# EasyEDA Pro project AG6NS_PicoBalloon_RP2040_v0.31.eprj, schematic Schematic1
Create Date: 2023-01-16; Page Name: P1; Project Name: PicoBalloon RP2040 v0.31; Schematic Name: Schematic1; Update Date: 2023-05-23; Company: AG6NS  Kazu Terasaki; Drawed: EasyEDA Pro; Page Size: A3; Part Number: JLCPCB-001; Reviewed: EasyEDA Pro; Version: 2023.05.17
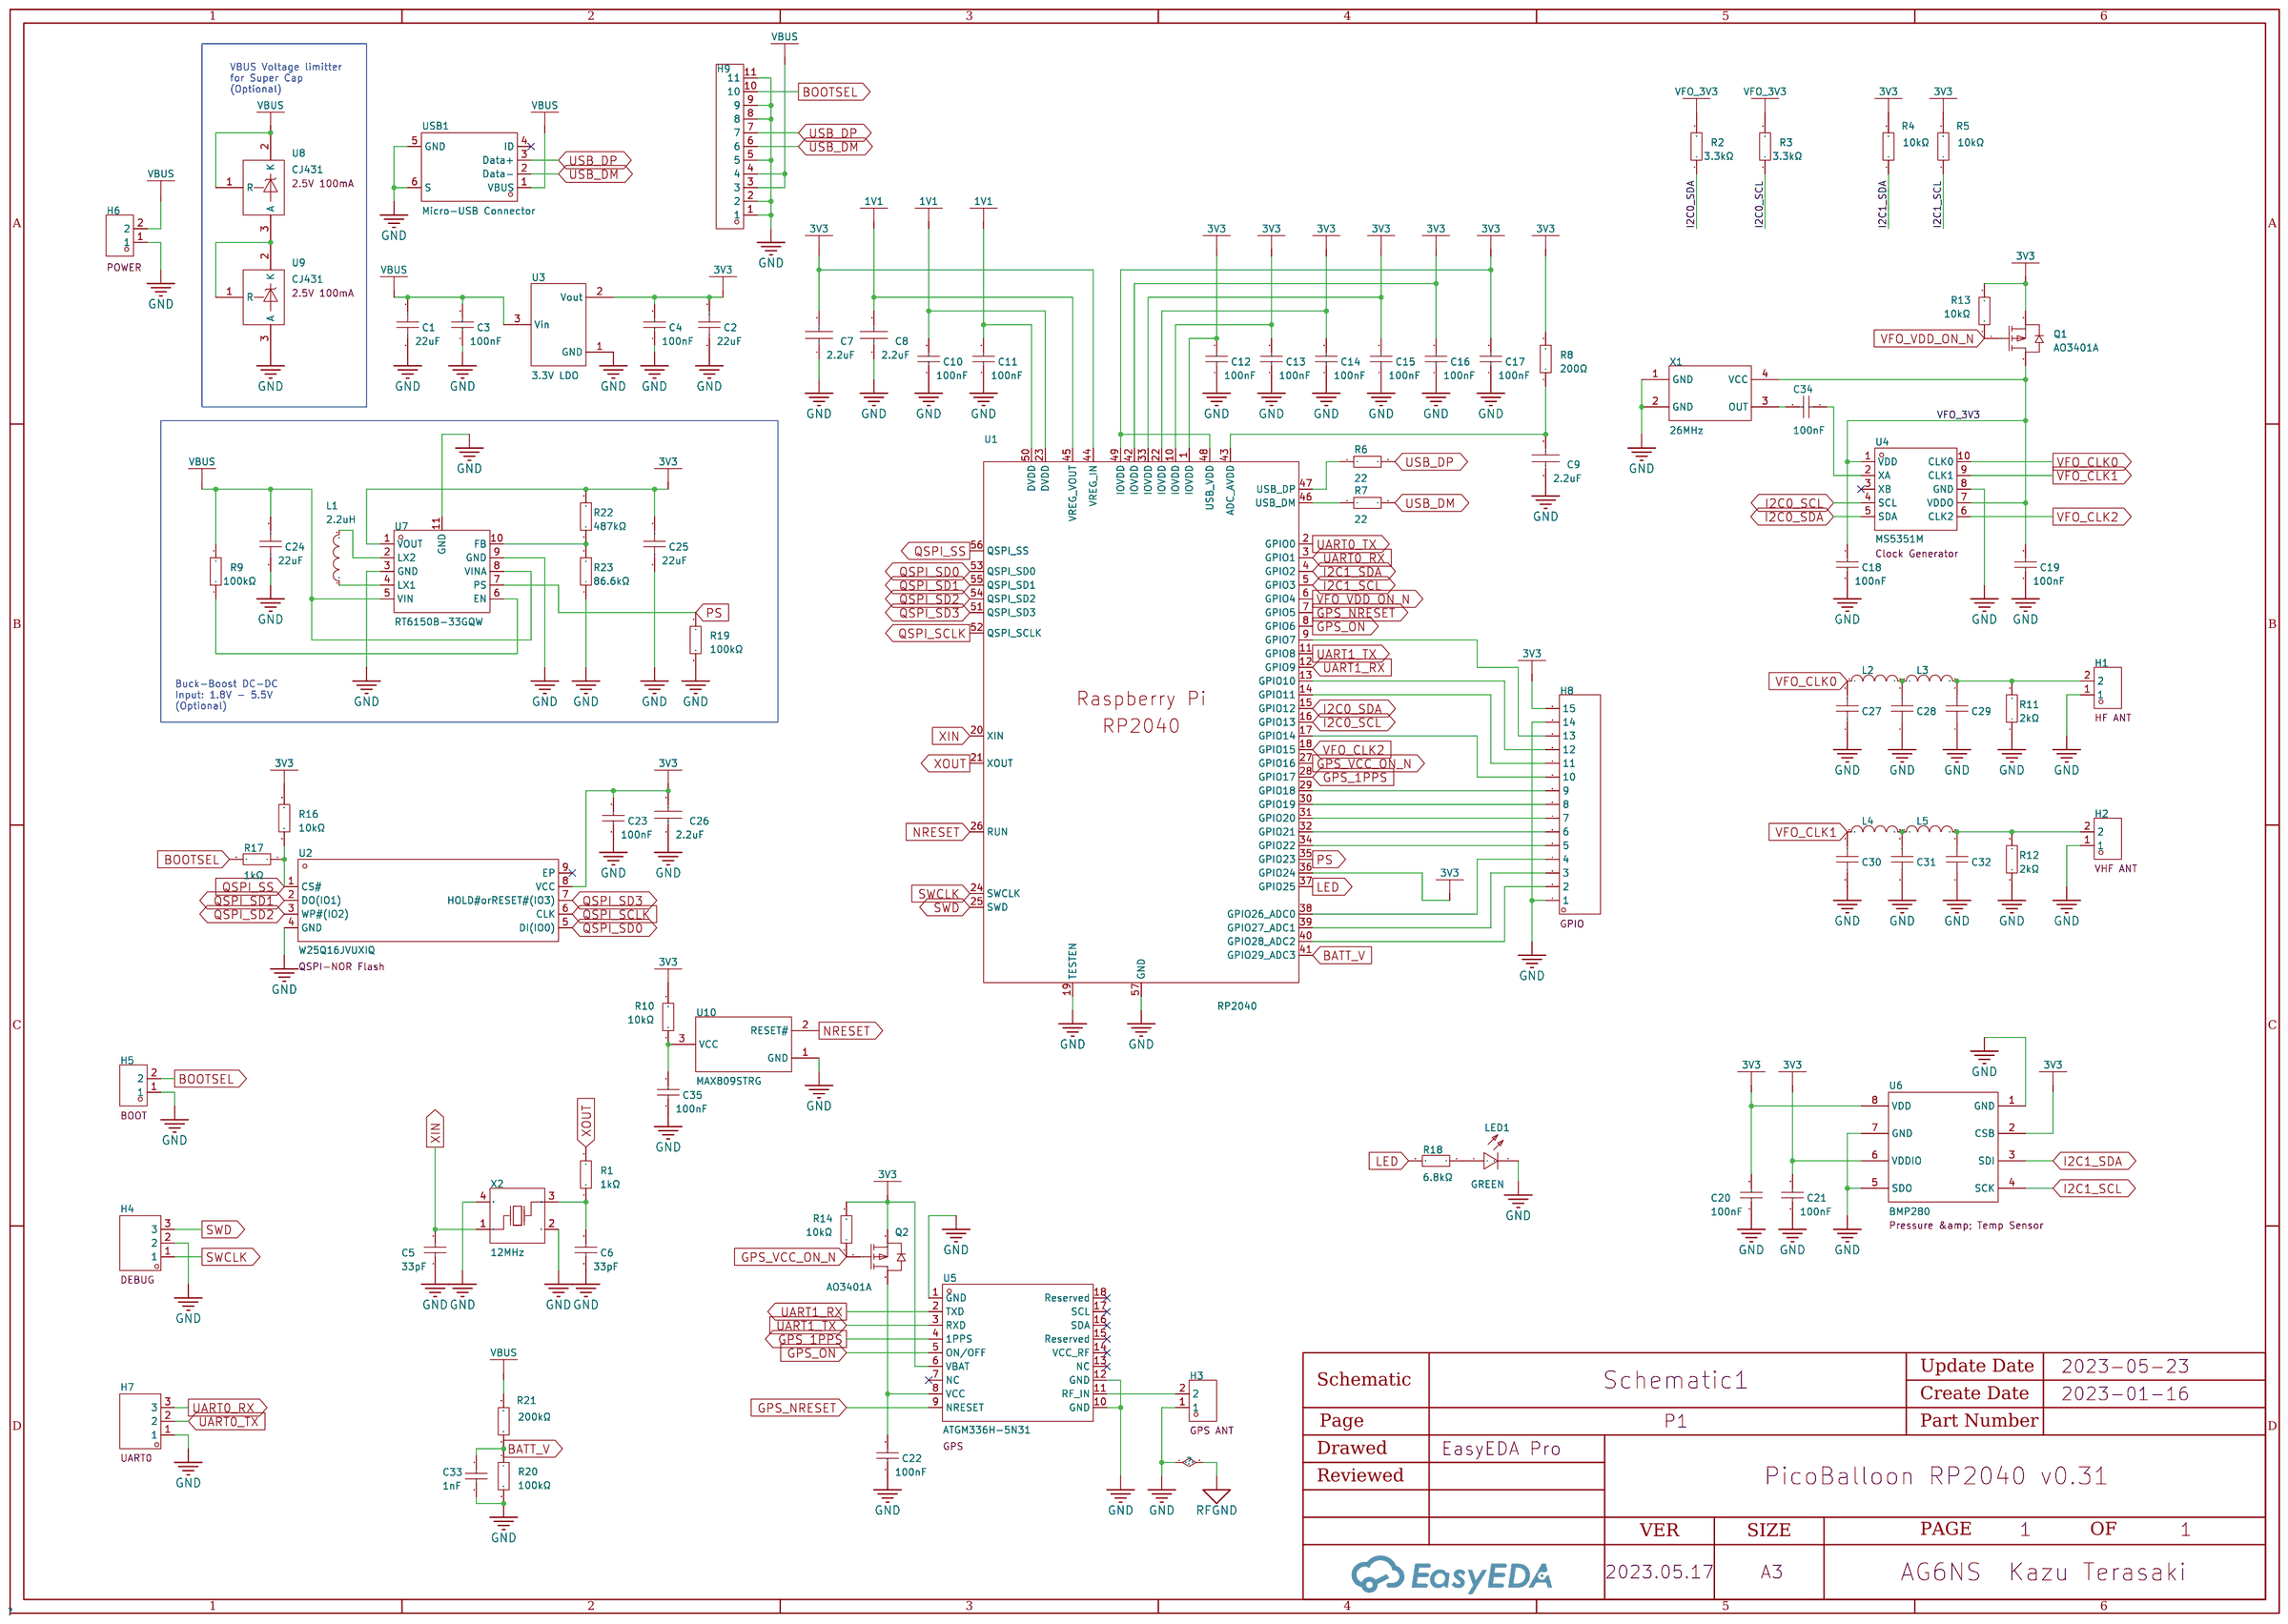
[diagram p0: schematic sheet]

## Parts
C1  22uF  [C0805]
C2  22uF  [C0603]
C3  100nF  [C0402_NEW]
C4  100nF  [C0402_NEW]
C5  33pF  [C0402]
C6  33pF  [C0402]
C7  2.2uF  [C0402]
C8  2.2uF  [C0402]
C9  2.2uF  [C0402]
C10  100nF  [C0402_NEW]
C11  100nF  [C0402_NEW]
C12  100nF  [C0402_NEW]
C13  100nF  [C0402_NEW]
C14  100nF  [C0402_NEW]
C15  100nF  [C0402_NEW]
C16  100nF  [C0402_NEW]
C17  100nF  [C0402_NEW]
C18  100nF  [C0402_NEW]
C19  100nF  [C0402_NEW]
C20  100nF  [C0402_NEW]
C21  100nF  [C0402_NEW]
C22  100nF  [C0402_NEW]
C23  100nF  [C0402_NEW]
C24  22uF  [C0805]  (no BOM)
C25  22uF  [C0603]  (no BOM)
C26  2.2uF  [C0402]
C27  330pF  [C0805]  (no BOM)
C28  330pF  [C0805]  (no BOM)
C29  330pF  [C0805]  (no BOM)
C30  330pF  [C0805]  (no BOM)
C31  330pF  [C0805]  (no BOM)
C32  330pF  [C0805]  (no BOM)
C33  1nF  [C0402]
C34  100nF  [C0402_NEW]
C35  100nF  [C0402_NEW]
H1  210-91-02GB01  [HDR-TH_2P-P2.54-V-M-1]  (no BOM)
H2  210-91-02GB01  [HDR-TH_2P-P2.54-V-M-1]  (no BOM)
H3  210-91-02GB01  [HDR-TH_2P-P2.54-V-M-1]  (no BOM)
H4  B-2100S03P-A110  [HDR-TH_3P-P2.54-V-M-1]  (no BOM)
H5  210-91-02GB01  [HDR-TH_2P-P2.54-V-M-1]  (no BOM)
H6  210-91-02GB01  [HDR-TH_2P-P2.54-V-M-1]  (no BOM)
H7  B-2100S03P-A110  [HDR-TH_3P-P2.54-V-M-1]  (no BOM)
H8  B-2100S15P-A110  [HDR-TH_15P-P2.54-V-M]  (no BOM)
H9  A2541WV-11P  [HDR-TH_11P-P2.54-V-M]  (no BOM)
L1  2.2uH  [IND-SMD_L3.0-W3.0]  (no BOM)
L2  820nH  [L0805]  (no BOM)
L3  820nH  [L0805]  (no BOM)
L4  820nH  [L0805]  (no BOM)
L5  820nH  [L0805]  (no BOM)
LED1  GREEN  [LED0603-R-RD]
Q1  AO3401A  [SOT-23_L2.9-W1.3-P1.90-LS2.4-BR]
Q2  AO3401A  [SOT-23_L2.9-W1.3-P1.90-LS2.4-BR]
R1  1kΩ  [R0402]
R2  3.3kΩ  [R0402]
R3  3.3kΩ  [R0402]
R4  10kΩ  [R0402]
R5  10kΩ  [R0402]
R6  22  [R0402]
R7  22  [R0402]
R8  200Ω  [R0402]
R9  100kΩ  [R0402]  (no BOM)
R10  10kΩ  [R0402]
R11  2kΩ  [R0805]
R12  2kΩ  [R0805]
R13  10kΩ  [R0402]
R14  10kΩ  [R0402]
R16  10kΩ  [R0402]
R17  1kΩ  [R0402]
R18  6.8kΩ  [R0402]
R19  100kΩ  [R0402]  (no BOM)
R20  100kΩ  [R0402]
R21  200kΩ  [R0402]
R22  487kΩ  [R0402]  (no BOM)
R23  86.6kΩ  [R0402]  (no BOM)
U1  RP2040  [LQFN-56_L7.0-W7.0-P0.4-EP]
U2  W25Q16JVUXIQ  [USON-8_L3.0-W2.0-P0.50-BL-EP]
U3  3.3V LDO  [SOT-23-3_L2.9-W1.6-P1.90-LS2.8-BR]
U4  MS5351M  [MSOP-10_L3.0-W3.0-P0.50-LS5.0-BL]
U5  ATGM336H-5N31  [GPSM-SMD_ATGM336H-TR]
U6  BMP280  [WLGA-8_L2.5-W2.0-P0.65-TR_DPS422]
U7  RT6150B-33GQW  [TDFN-10_L2.5-W2.5-P0.50-BL-EP]  (no BOM)
U8  CJ431  [SOT-23-3_L2.9-W1.6-P1.90-LS2.8-BR]  (no BOM)
U9  CJ431  [SOT-23-3_L2.9-W1.6-P1.90-LS2.8-BR]  (no BOM)
U10  MAX809STRG  [SOT-23-3_L2.9-W1.6-P1.90-LS2.8-BR]
USB1  Micro-USB Connector  [MICRO-USB-SMD_10118194-0001LF]
X1  26MHz  [OSC-SMD_4P-L2.5-W2.0-BL]
X2  12MHz  [OSC-SMD_4P-L3.2-W2.5-BL]

## Library data of the parts
C1 C24 = CL21A226MAQNNNE_C45783: Capacitance: Tolerance:±20% Tolerance:±20% Voltage Rated: Temperature Coefficient:; LCSC Part Name: 22uF ±20% 25V; Supplier Part: C45783; Manufacturer: SAMSUNG(三星); Manufacturer Part: CL21A226MAQNNNE; Supplier Footprint: 0805; JLCPCB Part Class: Basic Part; Datasheet: https://atta.szlcsc.com/upload/public/pdf/source/20160103/1457707727161.pdf; Supplier: LCSC; Tolerance: ±20%
C2 C25 = CL10A226MQ8NRNC: Capacitance: Tolerance:±20% Tolerance:±20% Voltage Rated: Temperature Coefficient:; LCSC Part Name: 22uF ±20% 6.3V; Supplier Part: C59461; Manufacturer: SAMSUNG(三星); Supplier Footprint: 0603; JLCPCB Part Class: Basic Part; Datasheet: https://atta.szlcsc.com/upload/public/pdf/source/20160103/1457707740762.pdf; Supplier: LCSC; Tolerance: ±20%
C3 C4 C10-C23 C34 C35 = CL05B104KO5NNNC: Capacitance: Tolerance:±10% Tolerance:±10% Voltage Rated: Temperature Coefficient:; LCSC Part Name: 100nF ±10% 16V; Supplier Part: C1525; Manufacturer: SAMSUNG(三星); Supplier Footprint: 0402; JLCPCB Part Class: Basic Part; Datasheet: https://atta.szlcsc.com/upload/public/pdf/source/20160103/1457707674891.pdf; Supplier: LCSC; Tolerance: ±10%
C5 C6 = 0402CG330J500NT: Capacitance: Tolerance:±5% Tolerance:±5% Voltage Rated: Temperature Coefficient:; LCSC Part Name: 33pF ±5% 50V; Supplier Part: C1562; Manufacturer: FH(风华); Supplier Footprint: 0402; JLCPCB Part Class: Basic Part; Datasheet: https://atta.szlcsc.com/upload/public/pdf/source/20170923/C1562_1506149272462988369.pdf; Supplier: LCSC; Tolerance: ±5%
C7-C9 C26 = CL05A225MQ5NSNC: Capacitance: Tolerance:±20% Tolerance:±20% Voltage Rated: Temperature Coefficient:; LCSC Part Name: 2.2uF ±20% 6.3V; Supplier Part: C12530; Manufacturer: SAMSUNG(三星); Supplier Footprint: 0402; JLCPCB Part Class: Basic Part; Datasheet: https://atta.szlcsc.com/upload/public/pdf/source/20160103/1457707666860.pdf; Supplier: LCSC; Tolerance: ±20%
C27-C32 = CC0805GRNPO9BN331: Capacitance: Tolerance:±2% Tolerance:±2% Voltage Rated: Temperature Coefficient:; LCSC Part Name: 330pF ±2% 50V; Supplier Part: C520088; Manufacturer: YAGEO(国巨); Supplier Footprint: 0805; JLCPCB Part Class: Extended Part; Datasheet: https://atta.szlcsc.com/upload/public/pdf/source/20200423/C520088_35F99E8B5734DA5DA2E2C1A7D60382AF.pdf; Supplier: LCSC; Tolerance: ±2%
C33 = 0402B102K500NT: Capacitance: Tolerance:±10% Tolerance:±10% Voltage Rated: Temperature Coefficient:; LCSC Part Name: 1nF ±10% 50V; Supplier Part: C1523; Manufacturer: FH(风华); Supplier Footprint: 0402; JLCPCB Part Class: Basic Part; Datasheet: https://atta.szlcsc.com/upload/public/pdf/source/20170923/C1523_1506149254821988331.pdf; Supplier: LCSC; Tolerance: ±10%
H1 = 210-91-02GB01: HF ANT; LCSC Part Name: 2.54mm 1x2P 直插 方针 黑金; Supplier Part: C390678; Manufacturer: PINREX(频锐科技); Supplier Footprint: 插件,P=2.54mm; JLCPCB Part Class: Extended Part; Datasheet: https://atta.szlcsc.com/upload/public/pdf/source/20190506/C390678_4B5575196DD1118BCEB197AB5A397BC0.pdf; Supplier: LCSC; Number of Rows: 单排; Number of Pins: 2; Pitch: 2.54mm; Pin Structure: 1x2P; Mounting Type: Straight; Circluar Pins/Square Pins: Square Pins; Current Rating (Max): 3A; Length of Mating Pin: 6.1mm; Insulation Height: 2.5mm; Length of End Connection Pin: 3mm; Color: Black
H2 = 210-91-02GB01: VHF ANT; LCSC Part Name: 2.54mm 1x2P 直插 方针 黑金; Supplier Part: C390678; Manufacturer: PINREX(频锐科技); Supplier Footprint: 插件,P=2.54mm; JLCPCB Part Class: Extended Part; Datasheet: https://atta.szlcsc.com/upload/public/pdf/source/20190506/C390678_4B5575196DD1118BCEB197AB5A397BC0.pdf; Supplier: LCSC; Number of Rows: 单排; Number of Pins: 2; Pitch: 2.54mm; Pin Structure: 1x2P; Mounting Type: Straight; Circluar Pins/Square Pins: Square Pins; Current Rating (Max): 3A; Length of Mating Pin: 6.1mm; Insulation Height: 2.5mm; Length of End Connection Pin: 3mm; Color: Black
H3 = 210-91-02GB01: GPS ANT; LCSC Part Name: 2.54mm 1x2P 直插 方针 黑金; Supplier Part: C390678; Manufacturer: PINREX(频锐科技); Supplier Footprint: 插件,P=2.54mm; JLCPCB Part Class: Extended Part; Datasheet: https://atta.szlcsc.com/upload/public/pdf/source/20190506/C390678_4B5575196DD1118BCEB197AB5A397BC0.pdf; Supplier: LCSC; Number of Rows: 单排; Number of Pins: 2; Pitch: 2.54mm; Pin Structure: 1x2P; Mounting Type: Straight; Circluar Pins/Square Pins: Square Pins; Current Rating (Max): 3A; Length of Mating Pin: 6.1mm; Insulation Height: 2.5mm; Length of End Connection Pin: 3mm; Color: Black
H4 = B-2100S03P-A110: DEBUG; LCSC Part Name: 2.54mm 1x3P 直插; Supplier Part: C124376; Manufacturer: Ckmtw(灿科盟); Supplier Footprint: 插件,P=2.54mm; JLCPCB Part Class: Extended Part; Datasheet: https://atta.szlcsc.com/upload/public/pdf/source/20170821/C124376_1503303306347901528.pdf; Supplier: LCSC; Number of Rows: 单排; Number of Pins: 3; Pitch: 2.54mm; Pin Structure: 1x3P; Mounting Type: Straight; Length of Mating Pin: 6mm; Insulation Height: 2.54mm; Length of End Connection Pin: 3mm; Operating Temperature Range: -40~+105; Color: Black
H5 = 210-91-02GB01: BOOT; LCSC Part Name: 2.54mm 1x2P 直插 方针 黑金; Supplier Part: C390678; Manufacturer: PINREX(频锐科技); Supplier Footprint: 插件,P=2.54mm; JLCPCB Part Class: Extended Part; Datasheet: https://atta.szlcsc.com/upload/public/pdf/source/20190506/C390678_4B5575196DD1118BCEB197AB5A397BC0.pdf; Supplier: LCSC; Number of Rows: 单排; Number of Pins: 2; Pitch: 2.54mm; Pin Structure: 1x2P; Mounting Type: Straight; Circluar Pins/Square Pins: Square Pins; Current Rating (Max): 3A; Length of Mating Pin: 6.1mm; Insulation Height: 2.5mm; Length of End Connection Pin: 3mm; Color: Black
H6 = 210-91-02GB01: POWER; LCSC Part Name: 2.54mm 1x2P 直插 方针 黑金; Supplier Part: C390678; Manufacturer: PINREX(频锐科技); Supplier Footprint: 插件,P=2.54mm; JLCPCB Part Class: Extended Part; Datasheet: https://atta.szlcsc.com/upload/public/pdf/source/20190506/C390678_4B5575196DD1118BCEB197AB5A397BC0.pdf; Supplier: LCSC; Number of Rows: 单排; Number of Pins: 2; Pitch: 2.54mm; Pin Structure: 1x2P; Mounting Type: Straight; Circluar Pins/Square Pins: Square Pins; Current Rating (Max): 3A; Length of Mating Pin: 6.1mm; Insulation Height: 2.5mm; Length of End Connection Pin: 3mm; Color: Black
H7 = B-2100S03P-A110: UART0; LCSC Part Name: 2.54mm 1x3P 直插; Supplier Part: C124376; Manufacturer: Ckmtw(灿科盟); Supplier Footprint: 插件,P=2.54mm; JLCPCB Part Class: Extended Part; Datasheet: https://atta.szlcsc.com/upload/public/pdf/source/20170821/C124376_1503303306347901528.pdf; Supplier: LCSC; Number of Rows: 单排; Number of Pins: 3; Pitch: 2.54mm; Pin Structure: 1x3P; Mounting Type: Straight; Length of Mating Pin: 6mm; Insulation Height: 2.54mm; Length of End Connection Pin: 3mm; Operating Temperature Range: -40~+105; Color: Black
H8 = B-2100S15P-A110: GPIO; LCSC Part Name: 2.54mm 1x15P 直插; Supplier Part: C124373; Manufacturer: Ckmtw(灿科盟); Supplier Footprint: 插件,P=2.54mm; JLCPCB Part Class: Extended Part; Datasheet: https://atta.szlcsc.com/upload/public/pdf/source/20170821/C124373_1503303304753901525.pdf; Supplier: LCSC; Number of Rows: 单排; Number of Pins: 15; Pitch: 2.54mm; Pin Structure: 1x15P; Mounting Type: Straight; Length of Mating Pin: 6mm; Insulation Height: 2.54mm; Length of End Connection Pin: 3mm; Operating Temperature Range: -40~+105; Color: Black
H9 = A2541WV-11P: Number of Rows:单排 Number of Pins:11 Pitch:2.54mm Pin Structure:1x11P Row Spacing:- Mounting Type:Straight Circluar Pins/Square Pins:Square Pins Current Rating (Max):- Voltage Rating (Max):- Length of Mating Pin:6mm Insulation Height:2.54mm Length of End C; LCSC Part Name: 2.54mm 1x11P 直插 方针; Supplier Part: C225486; Manufacturer: CJT(长江连接器); Supplier Footprint: 插件,P=2.54mm; JLCPCB Part Class: Extended Part; Datasheet: https://atta.szlcsc.com/upload/public/pdf/source/20180509/C225486_2C9F57636B797421994AFF05CB656EE0.pdf; Supplier: LCSC; Number of Rows: 单排; Number of Pins: 11; Pitch: 2.54mm; Pin Structure: 1x11P; Mounting Type: Straight; Circluar Pins/Square Pins: Square Pins; Length of Mating Pin: 6mm; Insulation Height: 2.54mm; Length of End Connection Pin: 3mm; Operating Temperature Range: -40~+105; Color: Black
L1 = SPH3015H2R2MT: Inductance: Tolerance: Tolerance: Rated Current: DC Resistance (DCR):; LCSC Part Name: 2.2uH ±20% 1.5A 50mΩ; Supplier Part: C370424; Manufacturer: Sunlord(顺络); Supplier Footprint: SMD; JLCPCB Part Class: Extended Part; Datasheet: https://atta.szlcsc.com/upload/public/pdf/source/20210916/41BC1D61F1B8031533859732D09FE353.pdf; Supplier: LCSC
L2-L5 = MLF2012DR82JT000: Inductance: Tolerance: Tolerance: Rated Current: Saturation Current (Isat):- DC Resistance (DCR): Q @ Freq:25@25MHz Frequency - Self Resonant:130MHz Ratings:; LCSC Part Name: 820nH ±5% 400mΩ; Supplier Part: C76741; Manufacturer: TDK; Supplier Footprint: 0805; JLCPCB Part Class: Extended Part; Datasheet: https://atta.szlcsc.com/upload/public/pdf/source/20160918/1474166910853.pdf; Supplier: LCSC; Q @ Freq: 25@25MHz; Frequency - Self Resonant: 130MHz
LED1 = 19-217/GHC-YR1S2/3T: Emitted Color:Emerald Diode Configuration:- Lens Color:Colorless transparence Dominant Wavelength:520nm~535nm Dominant Wavelength:520nm~535nm Peak Wavelength:518nm Color Temperature:- Color Temperature:- Forward Current:20mA Power Dissipation:110mW Viewin; LCSC Part Name: 翠绿 520nm~535nm; Supplier Part: C72043; Manufacturer: EVERLIGHT(亿光); Supplier Footprint: 0603; JLCPCB Part Class: Basic Part; Datasheet: https://atta.szlcsc.com/upload/public/pdf/source/20160507/1462613613780.pdf; Supplier: LCSC; Emitted Color: Emerald; Lens Color: Colorless transparence; Dominant Wavelength: 520nm~535nm; Peak Wavelength: 518nm; Forward Current: 20mA; Power Dissipation: 110mW; Viewing Angle: 120°; Operating Temperature: -40~+85
Q1 Q2 = AO3401A_C15127: Type: Drain Source Voltage (Vdss): Continuous Drain Current (Id): Power Dissipation (Pd): Drain Source On Resistance (RDS(on)@Vgs,Id):44mΩ@10V,4.3A Gate Threshold Voltage (Vgs(th)@Id):1.3V@250uA; LCSC Part Name: P沟道 30V 4A; Supplier Part: C15127; Manufacturer: AOS; Supplier Footprint: SOT-23; JLCPCB Part Class: Basic Part; Datasheet: https://atta.szlcsc.com/upload/public/pdf/source/20160507/1462613609053.pdf; Supplier: LCSC; Drain Source On Resistance (RDS(on)@Vgs,Id): 44mΩ@10V,4.3A; Gate Threshold Voltage (Vgs(th)@Id): 1.3V@250uA
R1 R17 = 0402WGF1001TCE: Type:Thick Film Resistors Resistance: Tolerance:±1% Tolerance:±1% Power(Watts): Temperature Coefficient:±100ppm/ Temperature Coefficient:±100ppm/ Overload Voltage (Max): Operating Temperature Range:-55~+155 Operating Temperature Range:-55~+155; LCSC Part Name: 1kΩ ±1% 62.5mW; Supplier Part: C11702; Manufacturer: UNI-ROYAL(厚声); Supplier Footprint: 0402; JLCPCB Part Class: Basic Part; Datasheet: https://atta.szlcsc.com/upload/public/pdf/source/20200306/C422600_1E6D84923E4A46A82E41ADD87F860B5C.pdf; Supplier: LCSC; Type: Thick Film Resistors; Tolerance: ±1%; Temperature Coefficient: ±100ppm/; Operating Temperature Range: -55~+155
R2 R3 = 0402WGF3301TCE: LCSC Part Name: 3.3KΩ(3301) ±1% 编带; Supplier Part: C25890; Manufacturer: UNI-ROYAL(厚声); Supplier Footprint: 0402; JLCPCB Part Class: Basic Part; Datasheet: https://atta.szlcsc.com/upload/public/pdf/source/20170920/C25890_1505895100658980896.pdf; Supplier: LCSC
R4 R5 R10 R13 R14 R16 = 0402WGF1002TCE: Type:Thick Film Resistors Resistance: Tolerance:±1% Tolerance:±1% Power(Watts): Temperature Coefficient:±100ppm/ Temperature Coefficient:±100ppm/ Overload Voltage (Max): Operating Temperature Range:-55~+155 Operating Temperature Range:-55~+155; LCSC Part Name: 10kΩ ±1% 62.5mW; Supplier Part: C25744; Manufacturer: UNI-ROYAL(厚声); Supplier Footprint: 0402; JLCPCB Part Class: Basic Part; Datasheet: https://atta.szlcsc.com/upload/public/pdf/source/20200306/C422600_1E6D84923E4A46A82E41ADD87F860B5C.pdf; Supplier: LCSC; Type: Thick Film Resistors; Tolerance: ±1%; Temperature Coefficient: ±100ppm/; Operating Temperature Range: -55~+155
R6 R7 = 0402WGF220JTCE: LCSC Part Name: 22Ω(22R0) ±1% 编带; Supplier Part: C25092; Manufacturer: UNI-ROYAL(厚声); Supplier Footprint: 0402; JLCPCB Part Class: Basic Part; Datasheet: https://atta.szlcsc.com/upload/public/pdf/source/20170920/C25092_1505901206069982723.pdf; Supplier: LCSC
R8 = 0402WGF2000TCE: Type:Thick Film Resistors Resistance: Tolerance:±1% Tolerance:±1% Power(Watts): Temperature Coefficient:±100ppm/ Temperature Coefficient:±100ppm/ Overload Voltage (Max): Operating Temperature Range:-55~+155 Operating Temperature Range:-55~+155; LCSC Part Name: 200Ω ±1% 62.5mW; Supplier Part: C25087; Manufacturer: UNI-ROYAL(厚声); Supplier Footprint: 0402; JLCPCB Part Class: Basic Part; Datasheet: https://atta.szlcsc.com/upload/public/pdf/source/20200306/C422600_1E6D84923E4A46A82E41ADD87F860B5C.pdf; Supplier: LCSC; Type: Thick Film Resistors; Tolerance: ±1%; Temperature Coefficient: ±100ppm/; Operating Temperature Range: -55~+155
R9 R19 R20 = 0402WGF1003TCE: Type:Thick Film Resistors Resistance: Tolerance:±1% Tolerance:±1% Power(Watts): Temperature Coefficient:±100ppm/ Temperature Coefficient:±100ppm/ Overload Voltage (Max): Operating Temperature Range:-55~+155 Operating Temperature Range:-55~+155; LCSC Part Name: 100kΩ ±1% 62.5mW; Supplier Part: C25741; Manufacturer: UNI-ROYAL(厚声); Supplier Footprint: 0402; JLCPCB Part Class: Basic Part; Datasheet: https://atta.szlcsc.com/upload/public/pdf/source/20200306/C422600_1E6D84923E4A46A82E41ADD87F860B5C.pdf; Supplier: LCSC; Type: Thick Film Resistors; Tolerance: ±1%; Temperature Coefficient: ±100ppm/; Operating Temperature Range: -55~+155
R11 R12 = 0805W8F2001T5E: Type:Thick Film Resistors Resistance: Tolerance:±1% Tolerance:±1% Power(Watts): Temperature Coefficient:±100ppm/ Temperature Coefficient:±100ppm/ Overload Voltage (Max): Operating Temperature Range:-55~+155 Operating Temperature Range:-55~+155; LCSC Part Name: 2kΩ ±1% 125mW; Supplier Part: C17604; Manufacturer: UNI-ROYAL(厚声); Supplier Footprint: 0805; JLCPCB Part Class: Basic Part; Datasheet: https://atta.szlcsc.com/upload/public/pdf/source/20200306/C422600_1E6D84923E4A46A82E41ADD87F860B5C.pdf; Supplier: LCSC; Type: Thick Film Resistors; Tolerance: ±1%; Temperature Coefficient: ±100ppm/; Operating Temperature Range: -55~+155
R18 = 0402WGF6801TCE: Type:Thick Film Resistors Resistance: Tolerance:±1% Tolerance:±1% Power(Watts): Temperature Coefficient:±100ppm/ Temperature Coefficient:±100ppm/ Overload Voltage (Max): Operating Temperature Range:-55~+155 Operating Temperature Range:-55~+155; LCSC Part Name: 6.8kΩ ±1% 62.5mW; Supplier Part: C25917; Manufacturer: UNI-ROYAL(厚声); Supplier Footprint: 0402; JLCPCB Part Class: Basic Part; Datasheet: https://atta.szlcsc.com/upload/public/pdf/source/20200306/C422600_1E6D84923E4A46A82E41ADD87F860B5C.pdf; Supplier: LCSC; Type: Thick Film Resistors; Tolerance: ±1%; Temperature Coefficient: ±100ppm/; Operating Temperature Range: -55~+155
R21 = 0402WGF2003TCE: Resistance: Tolerance: Power(Watts): Temperature Coefficient: Temperature Coefficient: Overload Voltage (Max): Operating Temperature Range: Operating Temperature Range:; LCSC Part Name: 200KΩ ±1%; Supplier Part: C25764; Manufacturer: UNI-ROYAL(厚声); Supplier Footprint: 0402; JLCPCB Part Class: Basic Part; Datasheet: https://atta.szlcsc.com/upload/public/pdf/source/20170920/C25764_1505901532268983339.pdf; Supplier: LCSC
R22 = AC0402FR-07487KL: Type:Thick Film Resistors Resistance: Tolerance:±1% Tolerance:±1% Power(Watts): Temperature Coefficient:±100ppm/ Temperature Coefficient:±100ppm/ Overload Voltage (Max): Operating Temperature Range:-55~+155 Operating Temperature Range:-55~+155; LCSC Part Name: 487kΩ ±1% 62.5mW; Supplier Part: C227100; Manufacturer: YAGEO(国巨); Supplier Footprint: 0402; JLCPCB Part Class: Extended Part; Datasheet: https://atta.szlcsc.com/upload/public/pdf/source/20180906/C227100_D8E9EFBB6B1E0F244BF678806D90EE12.pdf; Supplier: LCSC; Type: Thick Film Resistors; Tolerance: ±1%; Temperature Coefficient: ±100ppm/; Operating Temperature Range: -55~+155
R23 = WR04X8662FTL: Resistance: Tolerance:±1% Tolerance:±1% Power(Watts): Temperature Coefficient:±100ppm/ Temperature Coefficient:±100ppm/ Overload Voltage (Max): Operating Temperature Range:-55~+155 Operating Temperature Range:-55~+155; LCSC Part Name: 86.6kΩ ±1% 62.5mW; Supplier Part: C172135; Manufacturer: Walsin(华新科); Supplier Footprint: 0402; JLCPCB Part Class: Extended Part; Datasheet: https://atta.szlcsc.com/upload/public/pdf/source/20180301/C172135_15198942775921383668.pdf; Supplier: LCSC; Tolerance: ±1%; Temperature Coefficient: ±100ppm/; Operating Temperature Range: -55~+155
U1 = RP2040_C2040: CPU Core:ARM Cortex-M0 Maximum Frequency:133MHz Supply Voltage Range:- Supply Voltage Range:- Internal Oscillator:- External Clock Frequency Rang:- External Clock Frequency Rang:- Program FLASH Size:- RAM Size:264KB EEPROM/Data FLASH Size:- GPIO Ports Num; LCSC Part Name: ARM Cortex-M0 133MHz RAM：264KB; Supplier Part: C2040; Manufacturer: Raspberry Pi(树莓派); Supplier Footprint: LQFN-56(7x7); JLCPCB Part Class: Extended Part; Datasheet: https://atta.szlcsc.com/upload/public/pdf/source/20210621/C2040_96F425825606B7957D87DD32E2512CA9.pdf; Supplier: LCSC; CPU Core: ARM Cortex-M0; Maximum Frequency: 133MHz; RAM Size: 264KB; GPIO Ports Number: 30; ADC (Units/Channels/bits): 1@x4ch/12bit; U(S)ART Number: 2; I2C Number: 2; (Q)SPI Number: 2; USB (H/D/OTG): USB Host/Device; Peripherals / Functions / Protocol Stacks: DMA；PWM
U2 = W25Q16JVUXIQ: QSPI-NOR Flash; Supplier Part: C2843335; Manufacturer: WINBOND(华邦); Supplier Footprint: USON-8; JLCPCB Part Class: Extended Part; Datasheet: https://atta.szlcsc.com/upload/public/pdf/source/20210629/C2843335_FB4D78B5076715625DC0C83F790D3044.pdf; Supplier: LCSC
U3 = XC6206P332MR_C5446: Output Type: Output Polarity:Positive Number of Outputs:1 Maximum Input Voltage:6V Output Voltage:3.3V~3.3V Output Voltage:3.3V~3.3V Dropout Voltage:680mV@(100mA) Output Current:200mA Power Supply Rejection Ratio (PSRR):-; LCSC Part Name: 正 Vin=6V Vout=3.3V 200mA; Supplier Part: C5446; Manufacturer: TOREX(特瑞仕); Manufacturer Part: XC6206P332MR; Supplier Footprint: SOT-23; JLCPCB Part Class: Basic Part; Datasheet: https://atta.szlcsc.com/upload/public/pdf/source/20130801/1457706628791.pdf; Supplier: LCSC; Output Polarity: Positive; Number of Outputs: 1; Maximum Input Voltage: 6V; Output Voltage: 3.3V~3.3V; Dropout Voltage: 680mV@(100mA); Output Current: 200mA
U4 = MS5351M: Clock Generator; Supplier Part: C1509083; Manufacturer: 杭州瑞盟; Supplier Footprint: MSOP-10; JLCPCB Part Class: Extended Part; Datasheet: https://atta.szlcsc.com/upload/public/pdf/source/20201224/C1509083_CDA7065E1A3FD8463EE02C96BD32A982.pdf; Supplier: LCSC; Interface: IIC; Output Frequency (Max): 200MHz; Supply Voltage: 2.25V~3.6V; Number of Outputs: 3; Output Low Voltage: 0.6V; Output High Voltage: 2.7V; Operating Temperatue: -55~+150
U5 = ATGM336H-5N31: GPS; Supplier Part: C90770; Manufacturer: 杭州中科微; Supplier Footprint: 9.7x10.1mm; JLCPCB Part Class: Extended Part; Datasheet: https://atta.szlcsc.com/upload/public/pdf/source/20161226/1482720799860.pdf; Supplier: LCSC
U6 = BMP280: Pressure &amp; Temp Sensor; Supplier Part: C83291; Manufacturer: Bosch(博世); Supplier Footprint: LGA-8; JLCPCB Part Class: Extended Part; Datasheet: https://atta.szlcsc.com/upload/public/pdf/source/20200702/C83291_F39E84AB7DFC569A4C7554F8659640A1.pdf; Supplier: LCSC
U7 = RT6150B-33GQW: Supplier Part: C3187669; Supplier Footprint: 10-WDFN(2.5x2.5); JLCPCB Part Class: Extended Part; Datasheet: https://atta.szlcsc.comnull; Supplier: LCSC
U8 U9 = CJ431_C3113: Output Type:Adjustable Output Voltage:2.5V~36V Output Voltage:2.5V~36V Output Current:100mA Tolerance:±0.5% Tolerance:±0.5% Temperature Coefficient:50ppm/ Minimum Cathode Current for Regulation:1mA Operating Temperature:-25~+85@(TA) Operating Temperatu; LCSC Part Name: 2.5V 100mA; Supplier Part: C3113; Manufacturer: CJ(江苏长电/长晶); Supplier Footprint: SOT-23-3L; JLCPCB Part Class: Basic Part; Datasheet: https://atta.szlcsc.com/upload/public/pdf/source/20180115/C3113_15160149461261269385.pdf; Supplier: LCSC; Output Type: Adjustable; Output Voltage: 2.5V~36V; Output Current: 100mA; Tolerance: ±0.5%; Temperature Coefficient: 50ppm/; Minimum Cathode Current for Regulation: 1mA; Operating Temperature: -25~+85@(TA)
U10 = MAX809STRG: Output Type:推挽 Reset Active Level:低电平有效 Number of Voltages Monitored:1 Threshold Voltage:2.93V Reset Timeout:140ms Operating Temperature:-40~+105@(TJ) Operating Temperature:-40~+105@(TJ) Type of the Power Management Chip:Simple reset/Power-on reset; LCSC Part Name: Voltage Supervisor, Very Low Supply Current, 3-Pin Microprocessor, Reset Monitor; Supplier Part: C9965; Manufacturer: onsemi(安森美); Supplier Footprint: SOT-23; JLCPCB Part Class: Extended Part; Datasheet: https://atta.szlcsc.com/upload/public/pdf/source/20170918/C9965_1505727085373976535.PDF; Supplier: LCSC; Output Type: 推挽; Reset Active Level: 低电平有效; Number of Voltages Monitored: 1; Threshold Voltage: 2.93V; Reset Timeout: 140ms; Operating Temperature: -40~+105@(TJ); Type of the Power Management Chip: Simple reset/Power-on reset
USB1 = 10118194-0001LF: Connector Type:Micro-B Standard:USB 2.0 Gender:Female Number of Contacts:5 Number of Ports:1; LCSC Part Name: Micro-B 母座; Supplier Part: C132563; Manufacturer: Amphenol; Supplier Footprint: SMD; JLCPCB Part Class: Extended Part; Datasheet: https://atta.szlcsc.com/upload/public/pdf/source/20210630/C132563_323781699BE9D7BFAD8DF70EA5820798.pdf; Supplier: LCSC; Connector Type: Micro-B; Standard: USB 2.0; Gender: Female; Number of Contacts: 5; Number of Ports: 1
X1 = 1XXB26000MAA: Frequency: Frequency Stability:±1.5ppm Frequency Stability:±1.5ppm Supply Voltage:1.8V~2.8V Supply Voltage:1.8V~2.8V Supply Current (Max): Operating Temperature: Operating Temperature:; LCSC Part Name: 26MHz ±1.5ppm; Supplier Part: C132296; Manufacturer: KDS(大真空); Supplier Footprint: SMD2520-4P; JLCPCB Part Class: Extended Part; Datasheet: https://atta.szlcsc.com/upload/public/pdf/source/20171018/C132296_15083234896291043042.pdf; Supplier: LCSC; Frequency Stability: ±1.5ppm; Supply Voltage: 1.8V~2.8V
X2 = X322512MSB4SI: Crystal Type:SMD Crystal Resonator Frequency: Frequency Tolerance:±10ppm Frequency Tolerance:±10ppm Frequency Stability:±30ppm Frequency Stability:±30ppm Load Capacitance: Operating Temperature: Operating Temperature:; LCSC Part Name: 12MHz ±10ppm 20pF; Supplier Part: C9002; Manufacturer: YXC(扬兴晶振); Supplier Footprint: SMD3225-4P; JLCPCB Part Class: Basic Part; Datasheet: https://atta.szlcsc.com/upload/public/pdf/source/20210329/C112971_1F611BDC486E193C1706F6D8EB5AA189.pdf; Supplier: LCSC; Crystal Type: SMD Crystal Resonator; Frequency Tolerance: ±10ppm; Frequency Stability: ±30ppm

## Nets
1V1: C8.2 C10.2 C11.2 U1.23(DVDD) U1.45(VREG_VOUT) U1.50(DVDD)
3V3: C2.2 C4.2 C7.2 C12.2 C13.2 C14.2 C15.2 C16.2 C17.2 C20.2 C21.2 C23.2 C25.2 C26.2 H8.15 Q1.2(S) Q2.2(S) R4.2 R5.2 R8.2 R10.2 R13.2 R14.2 R16.2 R22.2 U1.1(IOVDD) U1.10(IOVDD) U1.22(IOVDD) U1.33(IOVDD) U1.36(GPIO24) U1.42(IOVDD) U1.44(VREG_IN) U1.48(USB_VDD) U1.49(IOVDD) U2.8(VCC) U3.2(Vout) U5.6(VBAT) U6.2(CSB) U6.6(VDDIO) U6.8(VDD) U7.1(VOUT)
GND: C1.1 C2.1 C3.1 C4.1 C5.1 C6.1 C7.1 C8.1 C9.1 C10.1 C11.1 C12.1 C13.1 C14.1 C15.1 C16.1 C17.1 C18.1 C19.1 C20.1 C21.1 C22.1 C23.1 C24.1 C25.1 C26.1 C27.1 C28.1 C29.1 C30.1 C31.1 C32.1 C33.1 C35.1 H1.1 H2.1 H3.1 H4.2 H5.1 H6.1 H7.1 H8.1 H8.14 H9.1 H9.2 H9.5 H9.8 H9.9 H9.11 LED1.2(C) R11.1 R12.1 R19.2 R20.2 R23.1 U1.19(TESTEN) U1.57(GND) U2.4(GND) U3.1(GND) U4.8(GND) U5.1(GND) U5.10(GND) U5.12(GND) U6.1(GND) U6.5(SDO) U6.7(GND) U7.3(GND) U7.9(GND) U7.11(GND) U9.3(A) U10.1(GND) USB1.5(GND) USB1.6(S) X1.1(GND) X1.2(GND) X2.2(GND) X2.4(GND)
VBUS: C1.2 C3.2 C24.2 H6.2 H9.3 H9.4 R9.2 R21.2 U3.3(Vin) U7.5(VIN) U7.8(VINA) U8.1(R) U8.2(K) USB1.1(VBUS)
ADC0: H8.4 U1.38(GPIO26_ADC0)
ADC1: H8.3 U1.39(GPIO27_ADC1)
ADC2: H8.2 U1.40(GPIO28_ADC2)
ADC_AVDD: C9.2 R8.1 U1.43(ADC_AVDD)
BATT_V: C33.2 R20.1 R21.1 U1.41(GPIO29_ADC3)
BOOTSEL: H5.2 H9.10 R17.2
GPIO7: H8.13 U1.9(GPIO7)
GPIO10: H8.12 U1.13(GPIO10)
GPIO11: H8.11 U1.14(GPIO11)
GPIO14: H8.10 U1.17(GPIO14)
GPIO18: H8.9 U1.29(GPIO18)
GPIO19: H8.8 U1.30(GPIO19)
GPIO20: H8.7 U1.31(GPIO20)
GPIO21: H8.6 U1.32(GPIO21)
GPIO22: H8.5 U1.34(GPIO22)
GPS_1PPS: U1.28(GPIO17) U5.4(1PPS)
GPS_3V3: C22.2 Q2.3(D) U5.8(VCC)
GPS_ANT: H3.2 U5.11(RF_IN)
GPS_NRESET: U1.7(GPIO5) U5.9(NRESET)
GPS_ON: U1.8(GPIO6) U5.5(ON/OFF)
GPS_VCC_ON_N: Q2.1(G) R14.1 U1.27(GPIO16)
I2C0_SCL: R3.1 U1.16(GPIO13) U4.4(SCL)
I2C0_SDA: R2.1 U1.15(GPIO12) U4.5(SDA)
I2C1_SCL: R5.1 U1.5(GPIO3) U6.4(SCK)
I2C1_SDA: R4.1 U1.4(GPIO2) U6.3(SDI)
LED: R18.2 U1.37(GPIO25)
NRESET: U1.26(RUN) U10.2(RESET#)
PS: R19.1 U1.35(GPIO23) U7.7(PS)
QSPI_SCLK: U1.52(QSPI_SCLK) U2.6(CLK)
QSPI_SD0: U1.53(QSPI_SD0) U2.5(DI(IO0))
QSPI_SD1: U1.55(QSPI_SD1) U2.2(DO(IO1))
QSPI_SD2: U1.54(QSPI_SD2) U2.3(WP#(IO2))
QSPI_SD3: U1.51(QSPI_SD3) U2.7(HOLD#orRESET#(IO3))
QSPI_SS: R16.1 R17.1 U1.56(QSPI_SS) U2.1(CS#)
SWCLK: H4.1 U1.24(SWCLK)
SWD: H4.3 U1.25(SWD)
UART0_RX: H7.3 U1.3(GPIO1)
UART0_TX: H7.2 U1.2(GPIO0)
UART1_RX: U1.12(GPIO9) U5.2(TXD)
UART1_TX: U1.11(GPIO8) U5.3(RXD)
USB_DM: H9.6 R7.2 USB1.2(Data-)
USB_DP: H9.7 R6.2 USB1.3(Data+)
VFO_3V3: C18.2 C19.2 Q1.3(D) R2.2 R3.2 U4.1(VDD) U4.7(VDDO) X1.4(VCC)
VFO_CLK0: C27.2 L2.1 U4.10(CLK0)
VFO_CLK1: C30.2 L4.1 U4.9(CLK1)
VFO_CLK2: U1.18(GPIO15) U4.6(CLK2)
VFO_VDD_ON_N: Q1.1(G) R13.1 U1.6(GPIO4)
XIN: C5.2 U1.20(XIN) X2.1(OSC1)
XOUT: R1.2 U1.21(XOUT)
$1N4791: C34.1 U4.2(XA)
$1N22007: R7.1 U1.46(USB_DM)
$1N22362: R6.1 U1.47(USB_DP)
$1N30851: C28.2 L2.2 L3.1
$1N31392: C29.2 H1.2 L3.2 R11.2
$1N33309: C31.2 L4.2 L5.1
$1N33311: C32.2 H2.2 L5.2 R12.2
$1N60185: C34.2 X1.3(OUT)
$1N70752: C6.2 R1.1 X2.3(OSC2)
$1N107124: LED1.1(A) R18.1
$1N115739: C35.2 R10.1 U10.3(VCC)
Net-(L1-1): L1.1 U7.4(LX1)
Net-(L1-2): L1.2 U7.2(LX2)
Net-(R9-1): R9.1 U7.6(EN)
Net-(R22-1): R22.1 R23.2 U7.10(FB)
Net-(U8-3): U8.3(A) U9.1(R) U9.2(K)

Not connected (* = marked no-connect by the designer): U2 9(EP)*; U4 3(XB)*; U5 7(NC)* 13(NC)* 14(VCC_RF)* 15(Reserved)* 16(SDA)* 17(SCL)* 18(Reserved)*; USB1 4(ID)*

## Notes on the sheet
- VBUS Voltage limitter
  for Super Cap
  (Optional)
- Buck-Boost DC-DC
  Input: 1.8V - 5.5V
  (Optional)
